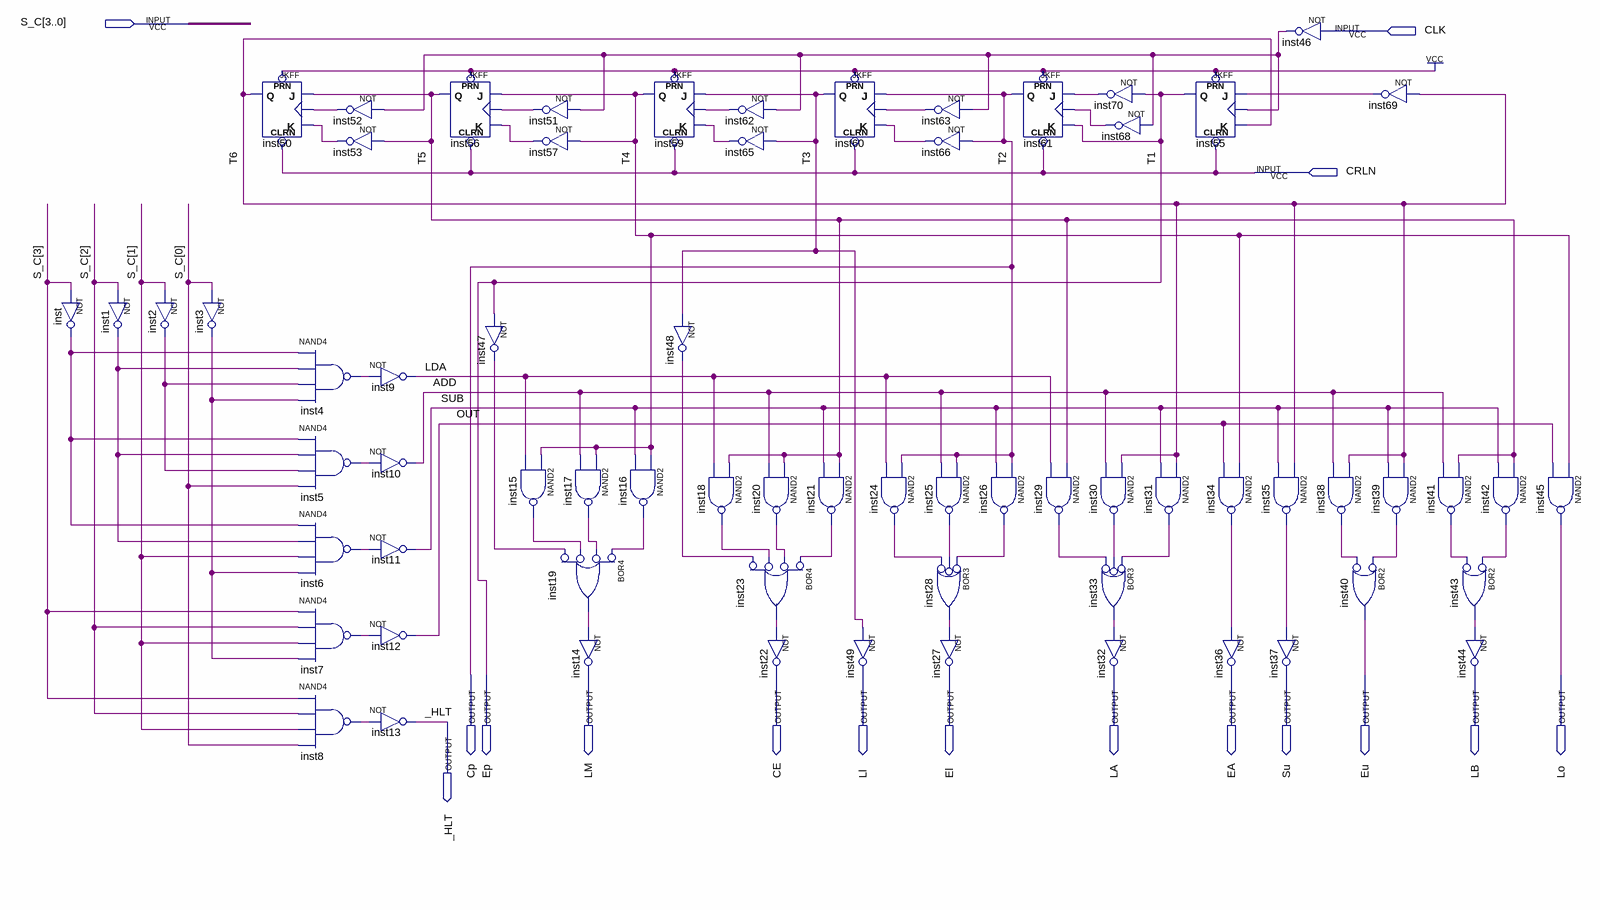
[diagram p0: schematic sheet]
// Quartus schematic controlador.bdf as structural Verilog: 67 symbols, 16 pins
module controlador (
  input  [3:0] S_C,
  input  CLK,
  input  CRLN,
  output Cp,
  output Ep,
  output LM,
  output CE,
  output Ll,
  output El,
  output LA,
  output EA,
  output Su,
  output Eu,
  output LB,
  output Lo,
  output _HLT
);

  wire ADD, inst1_out, inst2_out, inst3_out, inst4_out, inst5_out, inst6_out, inst7_out, inst8_out,
       inst15_out, inst16_out, inst17_out, inst18_out, inst19_out, inst20_out, inst21_out, inst23_out,
       inst24_out, inst25_out, inst26_out, inst28_out, inst29_out, inst30_out, inst31_out, inst33_out,
       inst34_out, inst35_out, inst38_out, inst39_out, inst41_out, inst42_out, inst43_out, inst46_out,
       inst47_out, inst48_out, inst51_out, inst52_out, inst53_out, inst57_out, inst62_out, inst63_out,
       inst65_out, inst66_out, inst68_out, inst69_out, inst70_out, inst_out, LDA, OUT, SUB, T3, T4, T5, T6;

  not inst (inst_out, S_C[3]);
  not inst1 (inst1_out, S_C[2]);
  not inst2 (inst2_out, S_C[1]);
  not inst3 (inst3_out, S_C[0]);
  JKFF inst50 (.PRN(1'b1), .CLRN(CRLN), .K(inst53_out), .J(T5), .CLK(inst52_out), .Q(T6));
  nand inst4 (inst4_out, inst_out, inst1_out, inst2_out, inst3_out);
  nand inst5 (inst5_out, inst_out, inst1_out, inst2_out, S_C[0]);
  nand inst6 (inst6_out, inst_out, inst1_out, S_C[1], inst3_out);
  nand inst7 (inst7_out, S_C[3], S_C[2], S_C[1], inst3_out);
  nand inst8 (inst8_out, S_C[3], S_C[2], S_C[1], S_C[0]);
  not inst52 (inst52_out, inst46_out);
  not inst53 (inst53_out, T5);
  not inst9 (LDA, inst4_out);
  not inst10 (ADD, inst5_out);
  not inst11 (SUB, inst6_out);
  not inst12 (OUT, inst7_out);
  not inst13 (_HLT, inst8_out);
  JKFF inst56 (.PRN(1'b1), .CLRN(CRLN), .K(inst57_out), .J(T4), .CLK(inst51_out), .Q(T5));
  not inst47 (inst47_out, Ep);
  not inst51 (inst51_out, inst46_out);
  not inst57 (inst57_out, T4);
  nand inst15 (inst15_out, T4, LDA);
  or inst19 (inst19_out, ~inst16_out, ~inst17_out, ~inst15_out, ~inst47_out);  // BOR4
  nand inst17 (inst17_out, T4, ADD);
  nand inst16 (inst16_out, T4, SUB);
  not inst14 (LM, inst19_out);
  JKFF inst59 (.PRN(1'b1), .CLRN(CRLN), .K(inst65_out), .J(T3), .CLK(inst62_out), .Q(T4));
  not inst48 (inst48_out, T3);
  not inst62 (inst62_out, inst46_out);
  not inst65 (inst65_out, T3);
  nand inst18 (inst18_out, T5, LDA);
  or inst23 (inst23_out, ~inst21_out, ~inst20_out, ~inst18_out, ~inst48_out);  // BOR4
  nand inst20 (inst20_out, T5, ADD);
  nand inst21 (inst21_out, T5, SUB);
  not inst22 (CE, inst23_out);
  JKFF inst60 (.PRN(1'b1), .CLRN(CRLN), .K(inst66_out), .J(Cp), .CLK(inst63_out), .Q(T3));
  nand inst24 (inst24_out, Cp, LDA);
  not inst49 (Ll, T3);
  not inst63 (inst63_out, inst46_out);
  not inst66 (inst66_out, Cp);
  nand inst25 (inst25_out, Cp, ADD);
  or inst28 (inst28_out, ~inst26_out, ~inst25_out, ~inst24_out);  // BOR3
  not inst27 (El, inst28_out);
  nand inst26 (inst26_out, Cp, SUB);
  JKFF inst61 (.PRN(1'b1), .CLRN(CRLN), .K(Ep), .J(inst70_out), .CLK(inst68_out), .Q(Cp));
  nand inst29 (inst29_out, T5, LDA);
  not inst70 (inst70_out, Ep);
  not inst68 (inst68_out, inst46_out);
  nand inst30 (inst30_out, T6, ADD);
  or inst33 (inst33_out, ~inst31_out, ~inst30_out, ~inst29_out);  // BOR3
  not inst32 (LA, inst33_out);
  JKFF inst55 (.PRN(1'b1), .CLRN(CRLN), .K(T6), .J(inst69_out), .CLK(inst46_out), .Q(Ep));
  nand inst31 (inst31_out, T6, SUB);
  nand inst34 (inst34_out, T4, OUT);
  not inst36 (EA, inst34_out);
  not inst46 (inst46_out, CLK);
  nand inst35 (inst35_out, T6, SUB);
  not inst37 (Su, inst35_out);
  not inst69 (inst69_out, T6);
  nand inst38 (inst38_out, T6, ADD);
  nand inst39 (inst39_out, T6, SUB);
  or inst40 (Eu, ~inst39_out, ~inst38_out);  // BOR2
  nand inst41 (inst41_out, T5, ADD);
  nand inst42 (inst42_out, T5, SUB);
  or inst43 (inst43_out, ~inst42_out, ~inst41_out);  // BOR2
  not inst44 (LB, inst43_out);
  nand inst45 (Lo, T4, OUT);

  // Other names for the same wires on the sheet: T2 = Cp; T1 = Ep
endmodule
